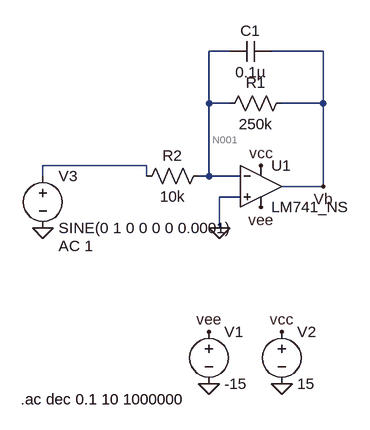
[diagram p0: schematic lab2_2.asc]
lab2_2.asc, the LTspice schematic file:
Version 4
SHEET 1 880 680
WIRE 304 80 272 80
WIRE 448 80 368 80
WIRE 272 160 272 80
WIRE 304 160 272 160
WIRE 448 160 448 80
WIRE 448 160 384 160
WIRE 176 256 16 256
WIRE 16 272 16 256
WIRE 176 272 176 256
WIRE 272 272 272 160
WIRE 272 272 256 272
WIRE 320 272 272 272
WIRE 448 288 448 160
WIRE 448 288 384 288
WIRE 320 304 288 304
WIRE 288 352 288 304
FLAG 272 592 0
FLAG 384 592 0
FLAG 352 256 vcc
FLAG 384 512 vcc
FLAG 272 512 vee
FLAG 352 320 vee
FLAG 288 352 0
FLAG 448 288 Vb
FLAG 16 352 0
SYMBOL cap 368 64 R90
WINDOW 0 0 32 VBottom 2
WINDOW 3 32 32 VTop 2
SYMATTR InstName C1
SYMATTR Value 0.1µ
SYMBOL res 400 144 R90
WINDOW 0 0 56 VBottom 2
WINDOW 3 32 56 VTop 2
SYMATTR InstName R1
SYMATTR Value 250k
SYMBOL AutoGenerated\\LM741_NS 352 224 R0
SYMATTR InstName U1
SYMBOL voltage 272 496 R0
WINDOW 123 0 0 Left 0
WINDOW 39 0 0 Left 0
SYMATTR InstName V1
SYMATTR Value -15
SYMBOL voltage 384 496 R0
WINDOW 123 0 0 Left 0
WINDOW 39 0 0 Left 0
SYMATTR InstName V2
SYMATTR Value 15
SYMBOL res 272 256 R90
WINDOW 0 0 56 VBottom 2
WINDOW 3 32 56 VTop 2
SYMATTR InstName R2
SYMATTR Value 10k
SYMBOL voltage 16 256 R0
WINDOW 123 24 124 Left 2
WINDOW 39 0 0 Left 0
SYMATTR InstName V3
SYMATTR Value SINE(0 1 0 0 0 0 0.0001)
SYMATTR Value2 AC 1
TEXT -18 616 Left 2 !.ac dec 0.1 10 1000000

The netlist it stands for:
* lab2_2.asc
C1 Vb N001 0.1µ
R1 Vb N001 250k
* U1: LM741_NS (symbol AutoGenerated\LM741_NS not available, pins judged from their places): In+=0 In-=N001 V+=vcc V-=vee OUT=Vb
V1 vee 0 -15
V2 vcc 0 15
R2 N001 N002 10k
V3 N002 0 SINE(0 1 0 0 0 0 0.0001) AC 1
.ac dec 0.1 10 1000000
.backanno
.end

* Results of the author's LTspice run, read from the files saved beside the schematic
* Operating Point, zero values left out:
*   V(vb) = 51.46 mV
*   V(n001) = 999.8 µV
*   V(vee) = -15 V
*   V(vcc) = 15 V
*   I(R2) = 99.98 nA
*   I(R1) = 201.8 nA
*   I(V3) = 99.98 nA
*   I(V2) = -1.701 mA
*   I(V1) = 1.701 mA
*   Ix(u1:1) = 57.86 nA
*   Ix(u1:2) = 101.9 nA
*   Ix(u1:99) = 1.701 mA
*   Ix(u1:50) = -1.701 mA
*   Ix(u1:28) = -201.8 nA